# EAGLE schematic kachisys (EAGLE 9.1.3)
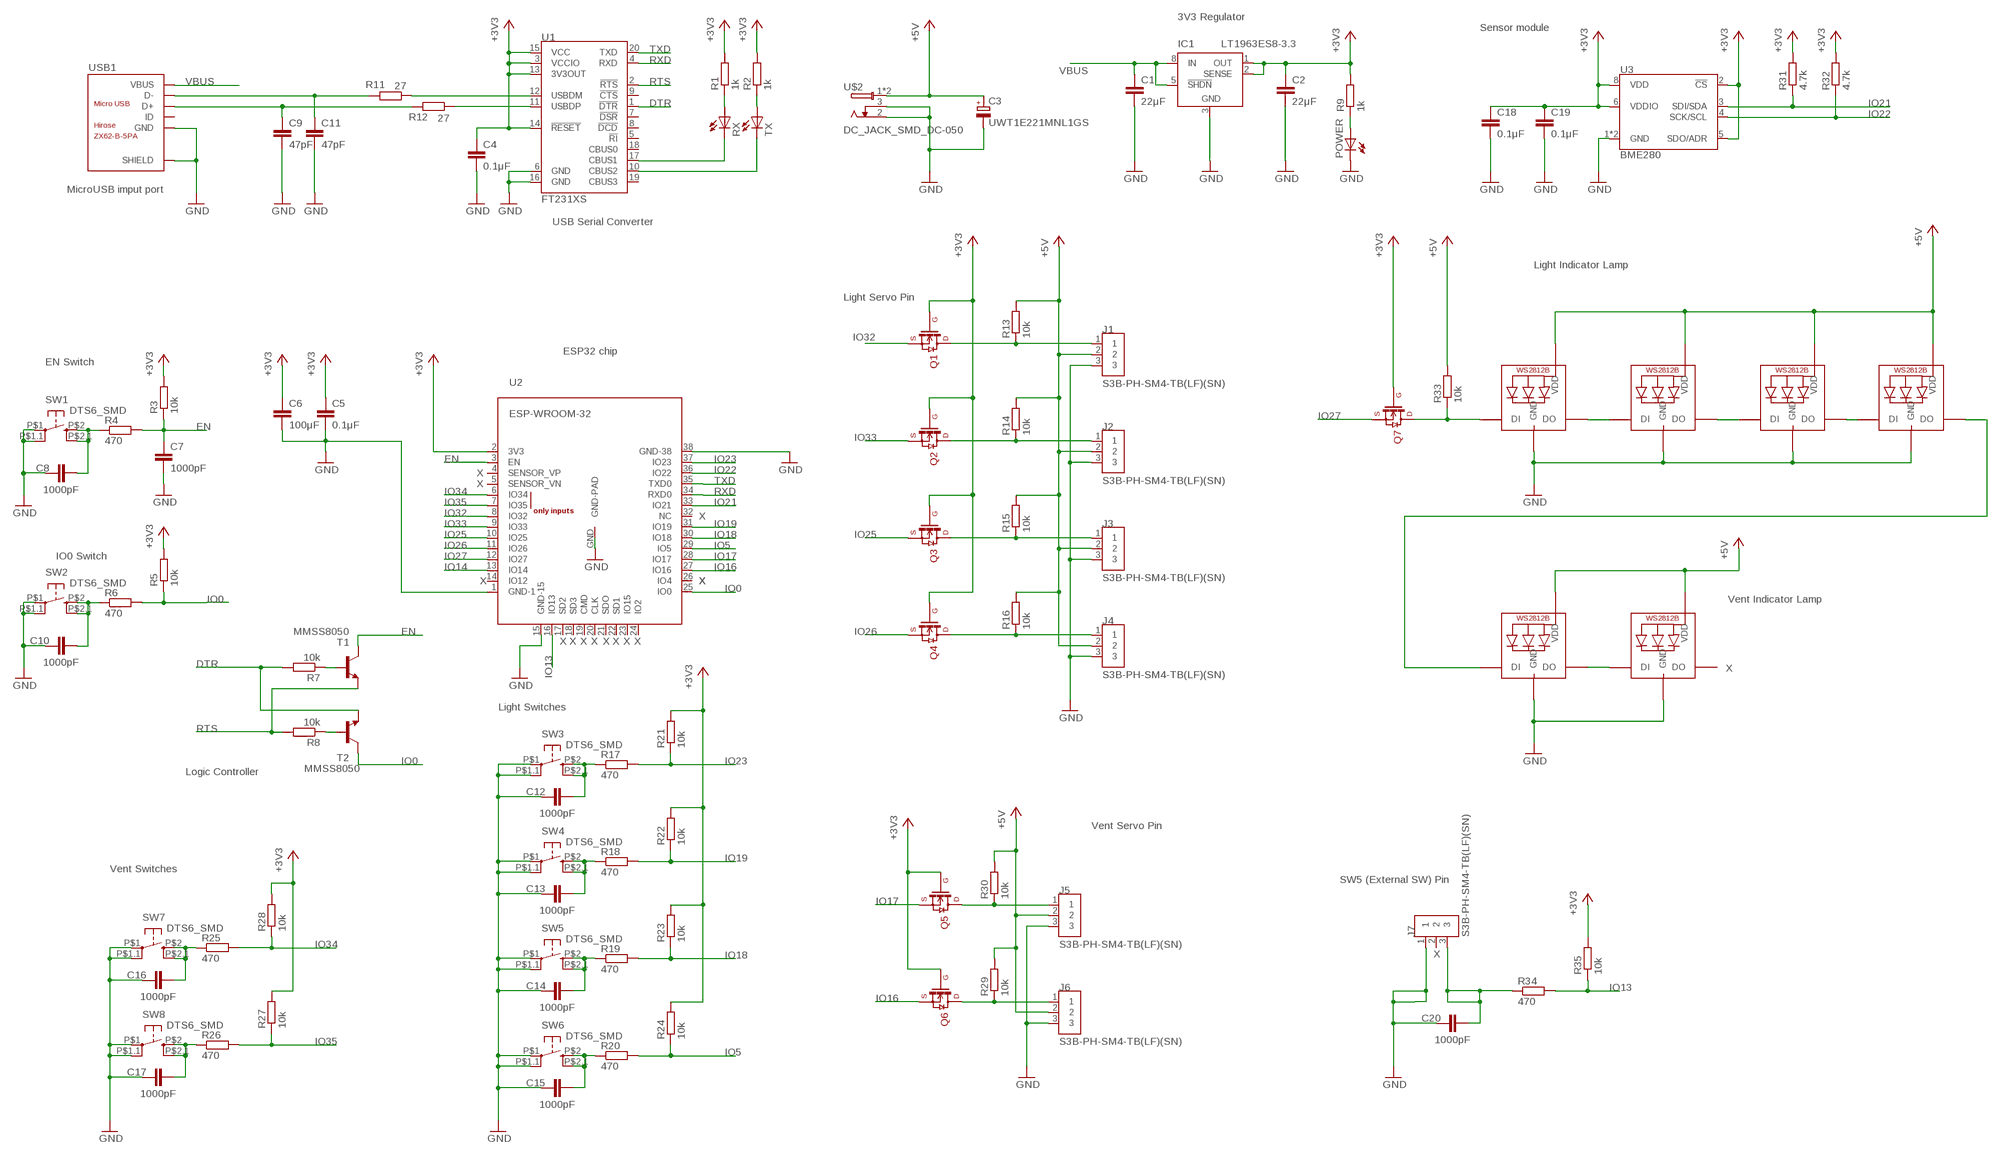
[diagram p0: schematic, sheet 1]

## Parts
C1  22μF  C-EUC2012  [C2012]
C2  22μF  C-EUC2012  [C2012]
C3  UWT1E221MNL1GS  [NICHICON-ALMINUM-CAPACITOR-8MM]
C4  0.1μF  C-EUC0603  [C0603]
C5  0.1μF  C-EUC0603  [C0603]
C6  100μF  C-EUC3225  [C3225]
C7  1000pF  C-EUC0603  [C0603]
C8  1000pF  C-EUC0603  [C0603]
C9  47pF  C-EUC1608  [C1608]
C10  1000pF  C-EUC0603  [C0603]
C11  47pF  C-EUC1608  [C1608]
C12  1000pF  C-EUC0603  [C0603]
C13  1000pF  C-EUC0603  [C0603]
C14  1000pF  C-EUC0603  [C0603]
C15  1000pF  C-EUC0603  [C0603]
C16  1000pF  C-EUC0603  [C0603]
C17  1000pF  C-EUC0603  [C0603]
C18  0.1μF  C-EUC0603  [C0603]
C19  0.1μF  C-EUC0603  [C0603]
C20  1000pF  C-EUC0603  [C0603]
IC1  LT1963ES8-3.3  [SOIC8]
J1  S3B-PH-SM4-TB(LF)(SN)  [JST_S3B-PH-SM4-TB(LF)(SN)]
J2  S3B-PH-SM4-TB(LF)(SN)  [JST_S3B-PH-SM4-TB(LF)(SN)]
J3  S3B-PH-SM4-TB(LF)(SN)  [JST_S3B-PH-SM4-TB(LF)(SN)]
J4  S3B-PH-SM4-TB(LF)(SN)  [JST_S3B-PH-SM4-TB(LF)(SN)]
J5  S3B-PH-SM4-TB(LF)(SN)  [JST_S3B-PH-SM4-TB(LF)(SN)]
J6  S3B-PH-SM4-TB(LF)(SN)  [JST_S3B-PH-SM4-TB(LF)(SN)]
J7  S3B-PH-SM4-TB(LF)(SN)  [JST_S3B-PH-SM4-TB(LF)(SN)]
LED1  WS2812B_5050N  [WS2812B-NARROW]
LED2  WS2812B_5050N  [WS2812B-NARROW]
LED3  WS2812B_5050N  [WS2812B-NARROW]
LED4  WS2812B_5050N  [WS2812B-NARROW]
LED5  WS2812B_5050N  [WS2812B-NARROW]
LED6  WS2812B_5050N  [WS2812B-NARROW]
POWER  LEDCHIP-LED0603  [CHIP-LED0603]
Q1  BSS138  [SOT-23]
Q2  BSS138  [SOT-23]
Q3  BSS138  [SOT-23]
Q4  BSS138  [SOT-23]
Q5  BSS138  [SOT-23]
Q6  BSS138  [SOT-23]
Q7  BSS138  [SOT-23]
R1  1k  R-EU_R0603  [R0603]
R2  1k  R-EU_R0603  [R0603]
R3  10k  R-EU_R0603  [R0603]
R4  470  R-EU_R0603  [R0603]
R5  10k  R-EU_R0603  [R0603]
R6  470  R-EU_R0603  [R0603]
R7  10k  R-EU_R0603  [R0603]
R8  10k  R-EU_R0603  [R0603]
R9  1k  R-EU_R0603  [R0603]
R11  27  R-EU_R0603  [R0603]
R12  27  R-EU_R0603  [R0603]
R13  10k  R-EU_R0603  [R0603]
R14  10k  R-EU_R0603  [R0603]
R15  10k  R-EU_R0603  [R0603]
R16  10k  R-EU_R0603  [R0603]
R17  470  R-EU_R0603  [R0603]
R18  470  R-EU_R0603  [R0603]
R19  470  R-EU_R0603  [R0603]
R20  470  R-EU_R0603  [R0603]
R21  10k  R-EU_R0603  [R0603]
R22  10k  R-EU_R0603  [R0603]
R23  10k  R-EU_R0603  [R0603]
R24  10k  R-EU_R0603  [R0603]
R25  470  R-EU_R0603  [R0603]
R26  470  R-EU_R0603  [R0603]
R27  10k  R-EU_R0603  [R0603]
R28  10k  R-EU_R0603  [R0603]
R29  10k  R-EU_R0603  [R0603]
R30  10k  R-EU_R0603  [R0603]
R31  4.7k  R-EU_R0603  [R0603]
R32  4.7k  R-EU_R0603  [R0603]
R33  10k  R-EU_R0603  [R0603]
R34  470  R-EU_R0603  [R0603]
R35  10k  R-EU_R0603  [R0603]
RX  LEDCHIP-LED0603  [CHIP-LED0603]
SW1  DTS6_SMD  [SKRPACE010]
SW2  DTS6_SMD  [SKRPACE010]
SW3  DTS6_SMD  [SKRPACE010]
SW4  DTS6_SMD  [SKRPACE010]
SW5  DTS6_SMD  [SKRPACE010]
SW6  DTS6_SMD  [SKRPACE010]
SW7  DTS6_SMD  [SKRPACE010]
SW8  DTS6_SMD  [SKRPACE010]
T1  MMSS8050  -NPN-SOT23-EBC  [SOT23-EBC]
T2  MMSS8050  -NPN-SOT23-EBC  [SOT23-EBC]
TX  LEDCHIP-LED0603  [CHIP-LED0603]
U1  FT231XS  [SSOP20_L]
U2  ESP-WROOM-32  [ESP-WROOM-32]
U3  BME280  [LGA-8-2.5X2.5]
U$2  DC_JACK_SMD_DC-050  [DC_JACK_SMD_DC-050]
USB1  ZX62-B-5PA  MICRO-USB-SMD(ZX62-B-5PA)  [MICRO-USB5+6P-SMD-0.65-AB]

## Nets
+3V3 [3V3]: C2.1 C4.1 C5.1 C6.1 C18.1 C19.1 IC1.1(OUT) IC1.2(SENSE) Q1.G Q2.G Q3.G Q4.G Q5.G Q6.G Q7.G R1.2 R2.2 R3.2 R5.2 R9.2 R21.2 R22.2 R23.2 R24.2 R27.2 R28.2 R31.2 R32.2 R35.2 U1.3(VCCIO) U1.13(3V3OUT) U1.14(!RESET) U1.15(VCC) U2.2(3V3) U3.2(!CS) U3.5(SDO/ADR) U3.6(VDDIO) U3.8(VDD)
+5V [5V]: C3.POS(+) J1.2 J2.2 J3.2 J4.2 J5.2 J6.2 LED1.1-VDD(VDD) LED2.1-VDD(VDD) LED3.1-VDD(VDD) LED4.1-VDD(VDD) LED5.1-VDD(VDD) LED6.1-VDD(VDD) R13.2 R14.2 R15.2 R16.2 R29.2 R30.2 R33.2 U$2.1 U$2.1-1
DTR: R7.2 T2.E U1.1(!DTR)
EN: C7.1 R3.1 R4.2 T1.C U2.3(EN)
GND [GND]: C1.2 C2.2 C3.NEG(-) C4.2 C5.2 C6.2 C7.2 C8.1 C9.2 C10.1 C11.2 C12.1 C13.1 C14.1 C15.1 C16.1 C17.1 C18.2 C19.2 C20.1 IC1.3(GND) J1.3 J2.3 J3.3 J4.3 J5.3 J6.3 J7.1 LED1.3-GND(GND) LED2.3-GND(GND) LED3.3-GND(GND) LED4.3-GND(GND) LED5.3-GND(GND) LED6.3-GND(GND) POWER.C SW1.P$1(P) SW1.P$1.1(P1) SW2.P$1(P) SW2.P$1.1(P1) SW3.P$1(P) SW3.P$1.1(P1) SW4.P$1(P) SW4.P$1.1(P1) SW5.P$1(P) SW5.P$1.1(P1) SW6.P$1(P) SW6.P$1.1(P1) SW7.P$1(P) SW7.P$1.1(P1) SW8.P$1(P) SW8.P$1.1(P1) U1.6(GND) U1.16(GND) U2.1(GND-1) U2.15(GND-15) U2.38(GND-38) U2.GND(GND-PAD) U3.1(GND) U3.7(GND) U$2.2 U$2.3 USB1.5(GND) USB1.P1(SHIELD) USB1.P2(SHIELD) USB1.P3(SHIELD) USB1.P4(SHIELD) USB1.P5(SHIELD) USB1.P6(SHIELD)
IO0: R5.1 R6.2 T2.C U2.25(IO0)
IO5: R20.2 R24.1 U2.29(IO5)
IO13: R34.2 R35.1 U2.16(IO13)
IO14: U2.13(IO14)
IO16: Q6.S U2.27(IO16)
IO17: Q5.S U2.28(IO17)
IO18: R19.2 R23.1 U2.30(IO18)
IO19: R18.2 R22.1 U2.31(IO19)
IO21: R31.1 U2.33(IO21) U3.3(SDI/SDA)
IO22: R32.1 U2.36(IO22) U3.4(SCK/SCL)
IO23: R17.2 R21.1 U2.37(IO23)
IO25: Q3.S U2.10(IO25)
IO26: Q4.S U2.11(IO26)
IO27: Q7.S U2.12(IO27)
IO32: Q1.S U2.8(IO32)
IO33: Q2.S U2.9(IO33)
IO34: R25.2 R28.1 U2.6(IO34)
IO35: R26.2 R27.1 U2.7(IO35)
N$2: C11.1 R11.2 USB1.2(D-)
N$3: C9.1 R12.2 USB1.3(D+)
N$4: RX.C U1.17(CBUS1)
N$5: TX.C U1.10(CBUS2)
N$6: C8.2 R4.1 SW1.P$2(S) SW1.P$2.1(S1)
N$7: R1.1 RX.A
N$8: R2.1 TX.A
N$9: R7.1 T1.B
N$10: R8.1 T2.B
N$11: POWER.A R9.1
N$12: C10.2 R6.1 SW2.P$2(S) SW2.P$2.1(S1)
N$14: R11.1 U1.12(USBDM)
N$15: R12.1 U1.11(USBDP)
N$16: J1.1 Q1.D R13.1
N$17: J2.1 Q2.D R14.1
N$18: J3.1 Q3.D R15.1
N$19: J4.1 Q4.D R16.1
N$20: C12.2 R17.1 SW3.P$2(S) SW3.P$2.1(S1)
N$21: LED1.2-DOUT(DO) LED2.4-DIN(DI)
N$22: C13.2 R18.1 SW4.P$2(S) SW4.P$2.1(S1)
N$27: C14.2 R19.1 SW5.P$2(S) SW5.P$2.1(S1)
N$28: C15.2 R20.1 SW6.P$2(S) SW6.P$2.1(S1)
N$33: LED2.2-DOUT(DO) LED3.4-DIN(DI)
N$34: C16.2 R25.1 SW7.P$2(S) SW7.P$2.1(S1)
N$35: C17.2 R26.1 SW8.P$2(S) SW8.P$2.1(S1)
N$38: LED3.2-DOUT(DO) LED4.4-DIN(DI)
N$39: LED4.2-DOUT(DO) LED5.4-DIN(DI)
N$40: J5.1 Q5.D R30.1
N$41: J6.1 Q6.D R29.1
N$42: LED5.2-DOUT(DO) LED6.4-DIN(DI)
N$43: LED1.4-DIN(DI) Q7.D R33.1
N$46: C20.2 J7.3 R34.1
RTS: R8.2 T1.E U1.2(!RTS)
RXD: U1.4(RXD) U2.34(RXD0)
TXD: U1.20(TXD) U2.35(TXD0)
VBUS [5V]: C1.1 IC1.5(!SHDN) IC1.8(IN) USB1.1(VBUS)
Unconnected: IC1.4(NC) J7.2 LED6.2-DOUT(DO) U1.5(!RI) U1.7(!DSR) U1.8(!DCD) U1.9(!CTS) U1.18(CBUS0) U1.19(CBUS3) U2.4(SENSOR_VP) U2.5(SENSOR_VN) U2.14(IO12) U2.17(SD2) U2.18(SD3) U2.19(CMD) U2.20(CLK) U2.21(SDO) U2.22(SD1) U2.23(IO15) U2.24(IO2) U2.26(IO4) U2.32(NC) USB1.4(ID)

## Notes on the sheet
- 3V3 Regulator
- Sensor module
- MicroUSB imput port
- USB Serial Converter
- Light Indicator Lamp
- Light Servo Pin
- ESP32 chip
- EN Switch
- X
- X
- X
- IO0 Switch
- X | X | X
- Vent Indicator Lamp
- X | X | X | X | X | X | X | X
- X
- Light Switches
- Logic Controller
- Vent Servo Pin
- Vent Switches
- SW5 (External SW) Pin
- X

## Power pins joined to a net without a drawn wire
GND: IC1.6(GND) IC1.7(GND)

## Library data of the parts
C1 C2 C4-C8 C10 C12-C20 = resistor:C-EU: CAPACITOR, European symbol
C3 = taki-library:UWT1E221MNL1GS
C9 C11 = 150927 Library by matsu:C-EU: CAPACITOR, European symbol
IC1 = linear-technology:LT1963ES8: 1.5A, Low Noise, Fast Transient Response LDO Regulator Source: http://www.linear.com/pc/downloadDocument.do?navId=H0,C3,P2222,D3148; MPN: LT1963ES8-3.3; OC_FARNELL: unknown; OC_NEWARK: 57M7563
J1-J7 = S3B-PH-SM4-TB_LF__SN_:S3B-PH-SM4-TB(LF)(SN): CONN HEADER PH SIDE 3POS 2MM SMD; DESCRIPTION: PH Series 3 Position 2.0 mm SMT Side Entry Shrouded Header; DIGI-KEY_PART_NUMBER: 455-1750-1-ND; DIGI-KEY_PURCHASE_URL: https://www.digikey.jp/product-detail/en/jst-sales-america-inc/S3B-PH-SM4-TB_LF__SN_/455-1750-1-ND/926847?utm_source=snapeda&utm_medium=aggregator&utm_campaign=symbol; MF: JST Sales; MP: S3B-PH-SM4-TB_LF__SN_; PACKAGE: None
LED1-LED6 = adafruit:WS2812B
POWER RX TX = led:LED: LED OSRAM: - CHIPLED LG R971, LG N971, LY N971, LG Q971, LY Q971, LO R971, LY R971 LH N974, LH R974 LS Q976, LO Q976, LY Q976 LO Q996 - Hyper CHIPLED LW Q18S LB Q993, LB Q99A, LB R99A - SideLED LS A670, LO A670, LY A670, LG A670, LP A670 LB A673, LV A673, LT A673, LW A673 LH A674 LY A675 LS A676, LA A676, LO A676, LY A676, LW A676 LS A679, LY A679, LG A679 - Hyper Micro SIDELED® LS Y876, LA Y876, LO Y876, LY Y876 LT Y87S - SmartLED LW L88C, LW L88S LB L89C, LB L89S, LG L890 LS L89K, LO L89K, LY L89K LS L896, LA L896, LO L896, LY L896 - TOPLED LS T670, LO T670, LY T670, LG T670, LP T670 LSG T670, LSP T670, LSY T670, LOP T670, LYG T670 LG T671, LOG T671, LSG T671 LB T673, LV T673, LT T673, LW T673 LH T674 LS T676, LA T676, LO T676, LY T676, LB T676, LH T676, LSB T676, LW T676 LB T67C, LV T67C, LT T67C, LS T67K, LO T67K, LY T67K, LW E67C LS E67B, LA E67B, LO E67B, LY E67B, LB E67C, LV E67C, LT E67C LW T67C LS T679, LY T679, LG T679 LS T770, LO T770, LY T770, LG T770, LP T770 LB T773, LV T773, LT T773, LW T773 LH T774 LS E675, LA E675, LY E675, LS T675 LS T776, LA T776, LO T776, LY T776, LB T776 LHGB T686 LT T68C, LB T68C - Hyper Mini TOPLED® LB M676 - Mini TOPLED Santana® LG M470 LS M47K, LO M47K, LY M47K Source: http://www.osram.convergy.de LUXEON: - LUMILED® LXK2-PW12-R00, LXK2-PW12-S00, LXK2-PW14-U00, LXK2-PW14-V00 LXK2-PM12-R00, LXK2-PM12-S00, LXK2-PM14-U00 LXK2-PE12-Q00, LXK2-PE12-R00, LXK2-PE12-S00, LXK2-PE14-T00, LXK2-PE14-U00 LXK2-PB12-K00, LXK2-PB12-L00, LXK2-PB12-M00, LXK2-PB14-N00, LXK2-PB14-P00, LXK2-PB14-Q00 LXK2-PR12-L00, LXK2-PR12-M00, LXK2-PR14-Q00, LXK2-PR14-R00 LXK2-PD12-Q00, LXK2-PD12-R00, LXK2-PD12-S00 LXK2-PH12-R00, LXK2-PH12-S00 LXK2-PL12-P00, LXK2-PL12-Q00, LXK2-PL12-R00 Source: www.luxeon.com KINGBRIGHT: KA-3528ASYC Source: www.kingbright.com
Q1-Q7 = 180118 Library by matsu:BSS138
R1-R9 R11-R35 = resistor:R-EU_: RESISTOR, European symbol
SW1-SW8 = 180118 Library by matsu:DTS6_SMD
T1 T2 = transistor-neu-to92:*-NPN-: NPN Transistror
U1 = SparkFun-IC-Comms:FT231X: FTDI FT231X Full Speed USB to Full-handshake UART This USB2.0 Full Speed IC offers a compact bridge to full handshake UART interfaces. The device is a UART, capable of operating up to 3MBaud, with low power consumption (8mA). The FT231X includes the complete FT-X series feature set and enables USB to be added into a system design quickly and easily over a UART interface. Datasheet <http://cdn.sparkfun.com/datasheets/Components/General%20IC/DS_FT231X.pdf> SparkFun Products SparkFun RedBoard - Programmed with Arduino <https://www.sparkfun.com/products/12757> (DEV-12757) SparkFun XBee Explorer USB <https://www.sparkfun.com/products/11812> (WRL-11812) SparkFun XBee Explorer Dongle <https://www.sparkfun.com/products/11697> (WRL-11697) SparkFun Blynk Board - ESP8266 <https://www.sparkfun.com/products/13794> (WRL-13794) SparkFun ESP8266 Thing - Dev Board <https://www.sparkfun.com/products/13711> (WRL-13711) SparkFun Block for Intel® Edison - Base <https://www.sparkfun.com/products/13045> (DEV-13045) SparkFun RedStick <https://www.sparkfun.com/products/13741> (DEV-13741) SparkFun Beefy 3 - FTDI Basic Breakout <https://www.sparkfun.com/products/13746> (DEV-13746) SparkFun FT231X Breakout <https://www.sparkfun.com/products/11736> (BOB-11736); PROD_ID: IC-11524
U2 = taki-library:ESP-WROOM-32
U3 = taki-library:BME280: Bosch BME280 – Combined Humidity and Pressure Sensor The BME280 is as combined digital humidity, pressure and temperature sensor based on proven sensing principles. The sensor module is housed in an extremely compact metal-lid LGA package with a footprint of only 2.5×2.5mm² with a height of 0.93mm. Its small dimensions and its low power consumption allow the implementation in battery driven devices such as handsets, GPS modules or watches. Datasheet <https://cdn.sparkfun.com/assets/learn_tutorials/4/1/9/BST-BME280_DS001-10.pdf> SparkFun Products SparkFun Atmospheric Sensor Breakout - BME280 <https://www.sparkfun.com/products/13676> (SEN-13676); PROD_ID: IC-13090
U$2 = 180118 Library by matsu:DC_JACK_SMD_DC-050
USB1 = Seeed-Connector:MICRO-USB-SMD(ZX62-B-5PA): 320010005; MPN: ZX62-B-5PA